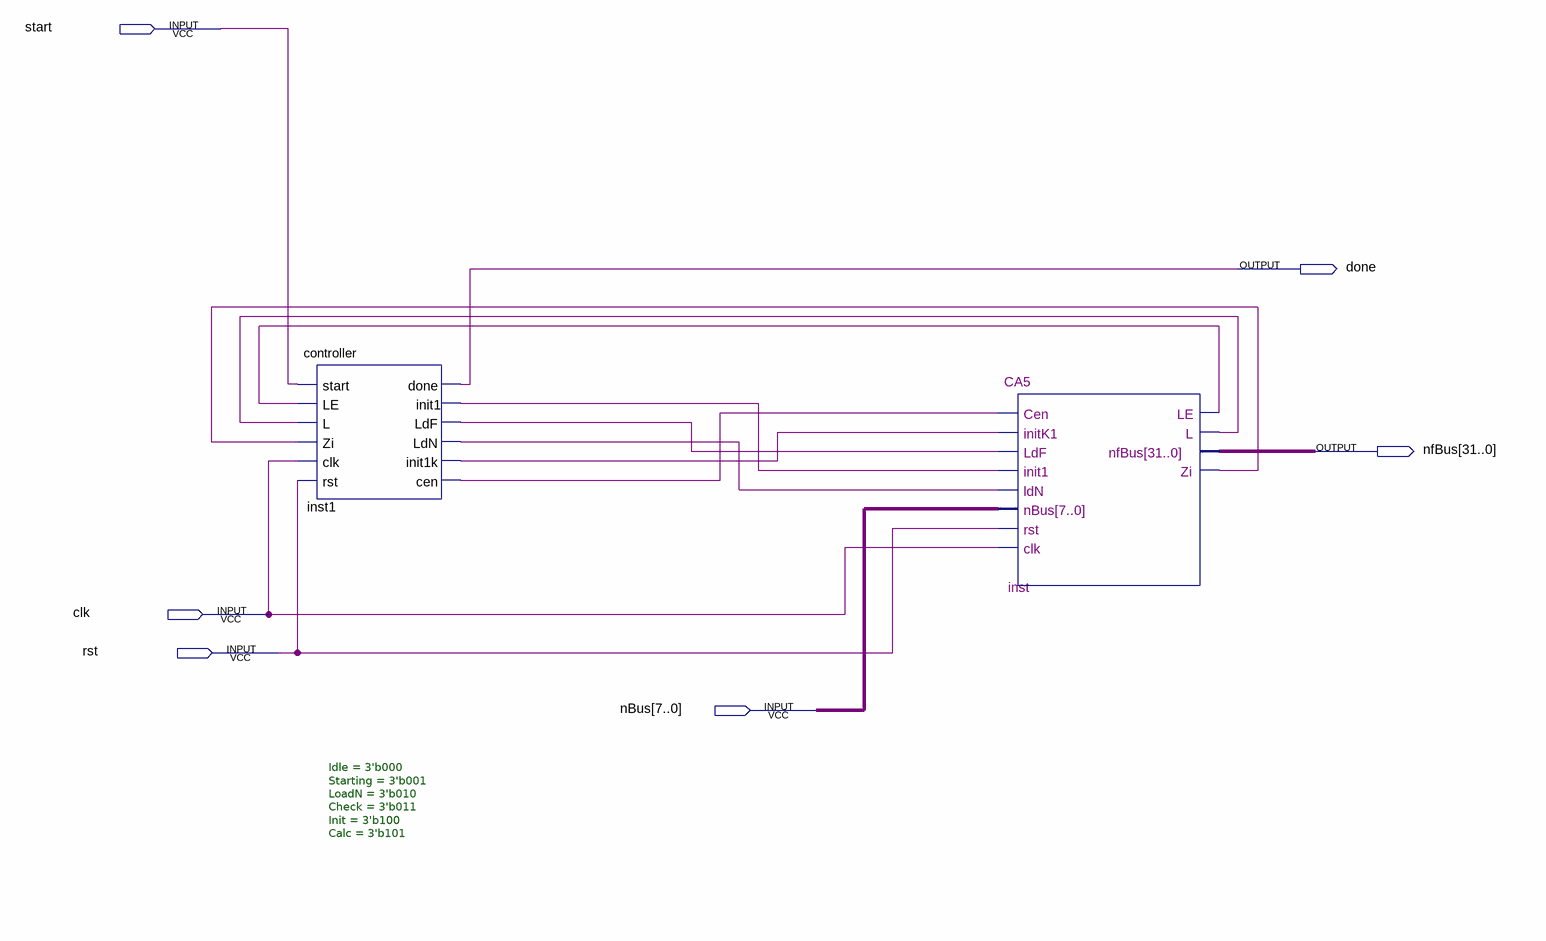
[diagram p0: schematic sheet]
// Quartus schematic Fact.bdf as structural Verilog: 2 symbols, 6 pins
module Fact (
  input  start,
  input  clk,
  input  rst,
  input  [7:0] nBus,
  output done,
  output [31:0] nfBus
);

  wire inst1_cen, inst1_init1, inst1_init1k, inst1_ldf, inst1_ldn, inst_l, inst_le, inst_zi;

  controller #(.Idle(3'b000), .Starting(3'b001), .LoadN(3'b010), .Check(3'b011), .Init(3'b100), .Calc(3'b101)) inst1 (
    .start(start), .LE(inst_le), .L(inst_l), .Zi(inst_zi), .clk(clk), .rst(rst), .done(done),
    .init1(inst1_init1), .LdF(inst1_ldf), .LdN(inst1_ldn), .init1k(inst1_init1k), .cen(inst1_cen));
  CA5 inst (
    .Cen(inst1_cen), .initK1(inst1_init1k), .LdF(inst1_ldf), .init1(inst1_init1), .ldN(inst1_ldn),
    .nBus(nBus), .rst(rst), .clk(clk), .LE(inst_le), .L(inst_l), .nfBus(nfBus), .Zi(inst_zi));
endmodule
